# Altium schematic sheet POWR0002_Tray2v1.SchDoc: Tray 2 High Level Power Layout
size A3; Engineer: C. BROWN; Organization: BLUEsat Project; Address1: Room 419; Address2: School of EE&T; Address3: UNSW, NSW 2052; Address4: Australia; DocumentNumber: POWR002; SheetNumber: 1; SheetTotal: 1; Description: Architectural illustration for power distribution devices; Version: 1.0; PageSetup: Record=PageOptions|CenterHorizontal=True|CenterVertical=True|PrintScale=1.00|XCorrection=1.00|YCorrection=1.00|PrintKind=0|BorderSize=5000000|LeftOffset=0|BottomOffset=0|Orientation=2|PaperLength=1000|PaperWidth=1000|Scale=100|PaperSource=7|PrintQuality=-4|MediaType=1|DitherType=10|PaperKind=A4|PrintScaleMode=1
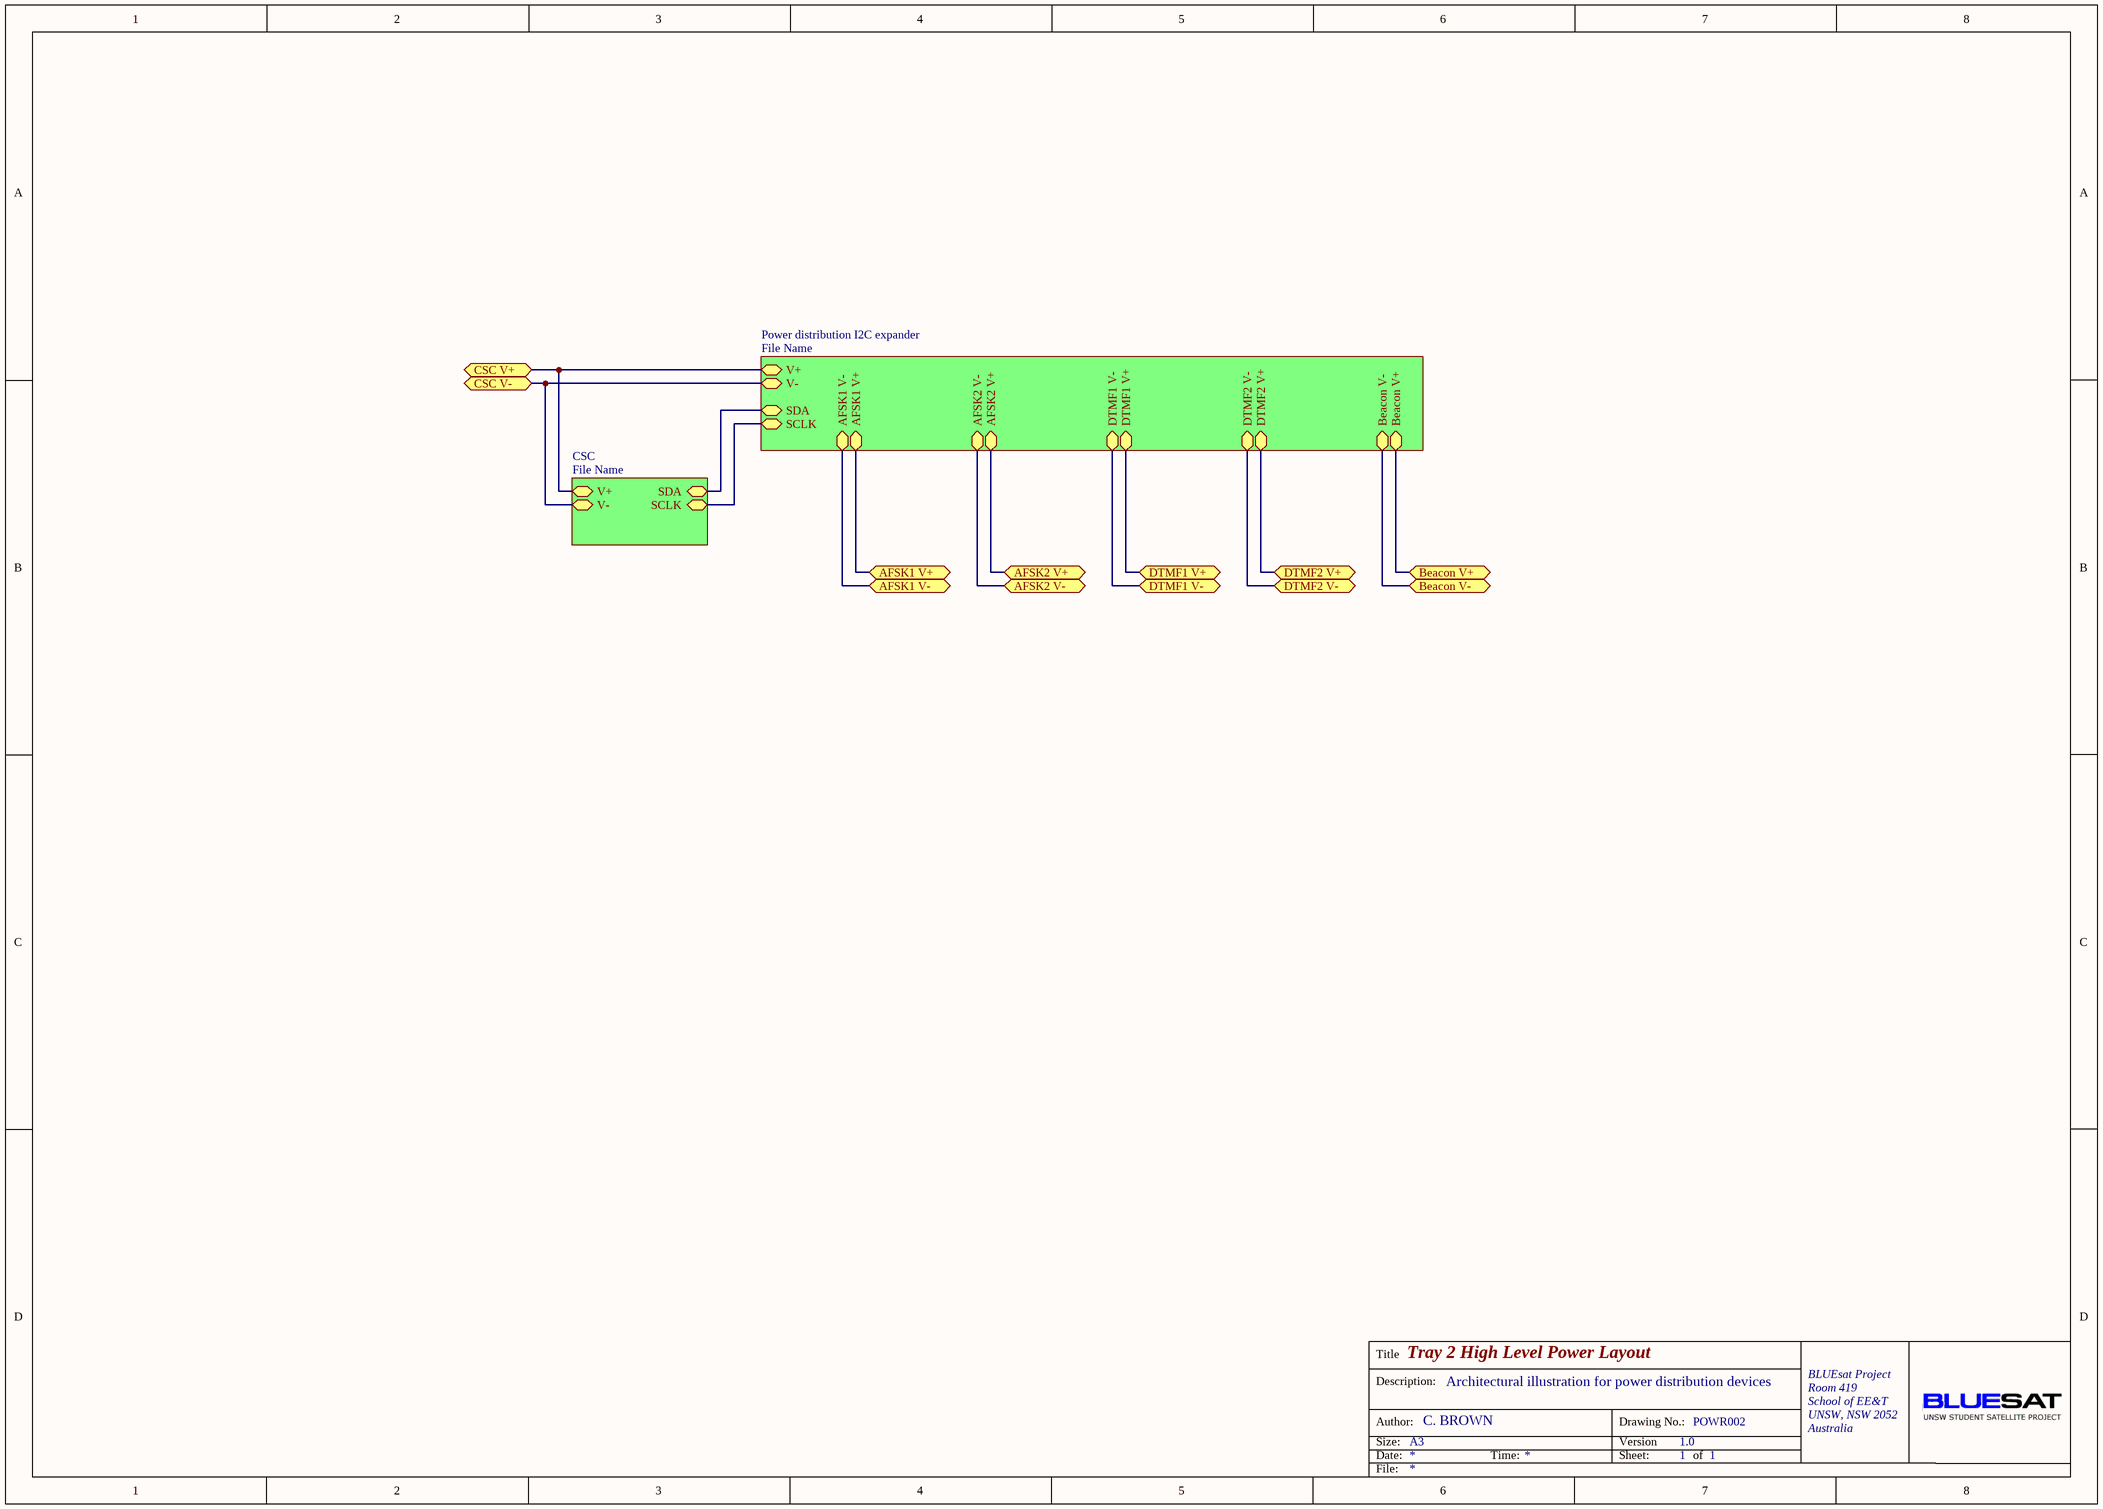
[diagram p0: POWR0002_Tray2v1.SchDoc]

## Sub-sheets
CSC = File Name: V+, V-, SDA, SCLK
Power distribution I2C expander = File Name: AFSK1 V+, AFSK2 V+, DTMF1 V+, DTMF2 V+, Beacon V+, SDA, SCLK, AFSK1 V-, AFSK2 V-, DTMF1 V-, DTMF2 V-, Beacon V-, V+, V-

## Ports
AFSK1 V+, AFSK1 V-, AFSK2 V+, AFSK2 V-, Beacon V+, Beacon V-, CSC V+, CSC V-, DTMF1 V+, DTMF1 V-, DTMF2 V+, DTMF2 V-

## Nets
AFSK1 V+: port AFSK1 V+, sheet Power distribution I2C expander/AFSK1 V+
AFSK1 V-: port AFSK1 V-, sheet Power distribution I2C expander/AFSK1 V-
AFSK2 V+: port AFSK2 V+, sheet Power distribution I2C expander/AFSK2 V+
AFSK2 V-: port AFSK2 V-, sheet Power distribution I2C expander/AFSK2 V-
Beacon V+: port Beacon V+, sheet Power distribution I2C expander/Beacon V+
Beacon V-: port Beacon V-, sheet Power distribution I2C expander/Beacon V-
CSC V+: port CSC V+, sheet Power distribution I2C expander/V+, sheet CSC/V+
CSC V-: port CSC V-, sheet Power distribution I2C expander/V-, sheet CSC/V-
DTMF1 V+: port DTMF1 V+, sheet Power distribution I2C expander/DTMF1 V+
DTMF1 V-: port DTMF1 V-, sheet Power distribution I2C expander/DTMF1 V-
DTMF2 V+: port DTMF2 V+, sheet Power distribution I2C expander/DTMF2 V+
DTMF2 V-: port DTMF2 V-, sheet Power distribution I2C expander/DTMF2 V-
(unnamed): sheet Power distribution I2C expander/SDA, sheet CSC/SDA
(unnamed): sheet Power distribution I2C expander/SCLK, sheet CSC/SCLK

## Notes on the sheet
- Title
- Description:
- Size:
- Author:
- Date:
- A3
- Time:
- Version
- Sheet:
- Drawing No.:
- of
- File: